# EAGLE design pll (EAGLE 7.2.0)
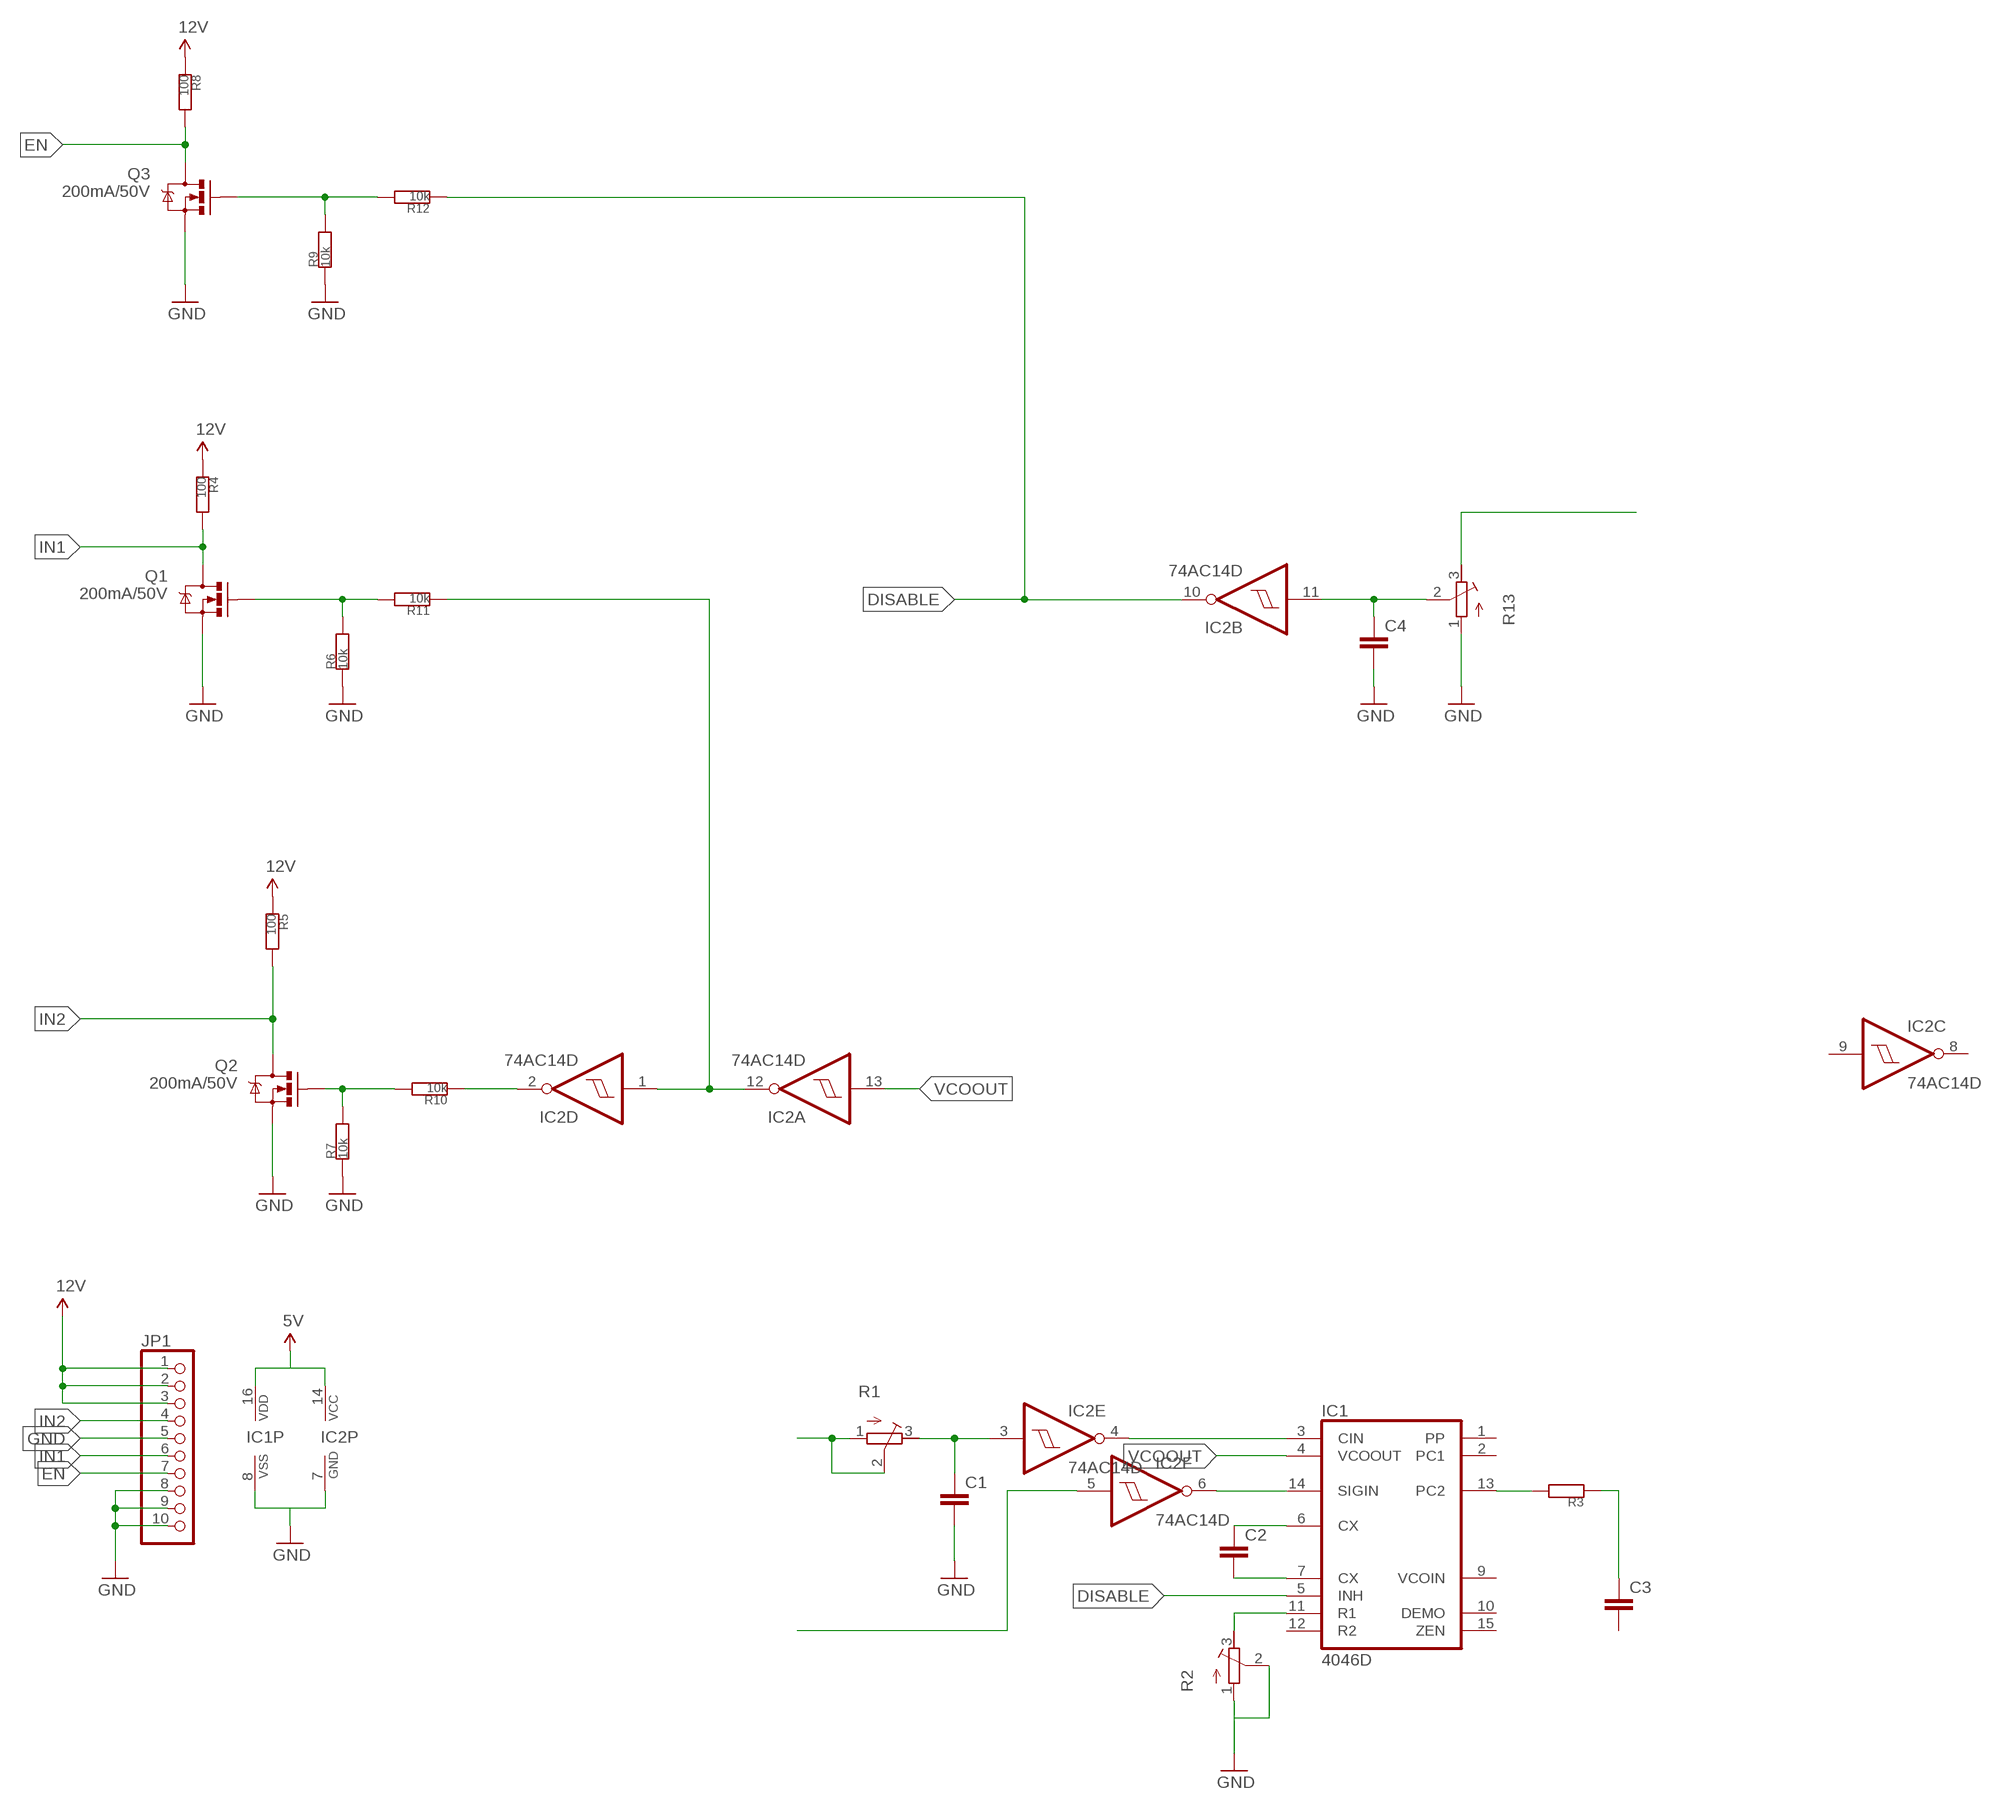
[diagram p0: schematic, sheet 1]

## Parts
C1  CC0805  [C0805]
C2  CC0805  [C0805]
C3  CC0805  [C0805]
C4  CC0805  [C0805]
IC1  4046D  [SO16]
IC2  74AC14D  [SO14]
JP1  PINHD-1X10  [1X10]
Q1  200mA/50V  MOSFET-NCHANNELBSS138  [SOT23-3]
Q2  200mA/50V  MOSFET-NCHANNELBSS138  [SOT23-3]
Q3  200mA/50V  MOSFET-NCHANNELBSS138  [SOT23-3]
R1  R-TRIMM64X  [RTRIM64X]
R2  R-TRIMM64X  [RTRIM64X]
R3  R0805  [R0805]
R4  100  R0805  [R0805]
R5  100  R0805  [R0805]
R6  10k  R0603  [0603]
R7  10k  R0603  [0603]
R8  100  R0805  [R0805]
R9  10k  R0603  [0603]
R10  10k  R0805  [R0805]
R11  10k  R0603  [0603]
R12  10k  R0603  [0603]
R13  R-TRIMM64X  [RTRIM64X]

## Nets
5V: IC1.16(VDD) IC2.14(P:VCC)
12V: JP1.1 JP1.2 JP1.3 R4.1 R5.1 R8.1
DISABLE: IC1.5(INH) IC2.10(B:O) R12.1
EN: JP1.7 Q3.3(D) R8.2
GND: C1.2 C4.2 IC1.8(VSS) IC2.7(P:GND) JP1.5 JP1.8 JP1.9 JP1.10 Q1.2(S) Q2.2(S) Q3.2(S) R2.1(A) R2.2(S) R6.1 R7.1 R9.1 R13.1(A)
IN1: JP1.6 Q1.3(D) R4.2
IN2: JP1.4 Q2.3(D) R5.2
N$1: IC1.14(SIGIN) IC2.6(F:O)
N$2: IC1.3(CIN) IC2.4(E:O)
N$3: C1.1 IC2.3(E:I) R1.3(E)
N$4: R1.1(A) R1.2(S)
N$5: C2.1 IC1.6(CX)
N$6: C2.2 IC1.7(CX)
N$7: Q3.1(G) R9.2 R12.2
N$8: IC2.1(D:I) IC2.12(A:O) R11.1
N$9: Q2.1(G) R7.2 R10.2
N$10: IC1.13(PC2) R3.2
N$11: C3.1 R3.1
N$13: Q1.1(G) R6.2 R11.2
N$14: IC2.5(F:I)
N$15: IC2.2(D:O) R10.1
N$16: IC1.11(R1) R2.3(E)
N$17: C4.1 IC2.11(B:I) R13.2(S)
N$18: R13.3(E)
VCOOUT: IC1.4(VCOOUT) IC2.13(A:I)
Unconnected: C3.2 IC1.1(PP) IC1.2(PC1) IC1.9(VCOIN) IC1.10(DEMO) IC1.12(R2) IC1.15(ZEN) IC2.8(C:O) IC2.9(C:I)

## Library data of the parts
C1-C4 = CasaLibrary:C: Capacitor
IC1 = 40xx:4046: Micropower PLL
IC2 = 74xx-eu:74*14: Hex schmitt trigger INVERTER
JP1 = pinhead:PINHD-1X10: PIN HEADER
Q1-Q3 = SparkFun-DiscreteSemi:MOSFET-NCHANNEL: Common NMOSFET Parts MFG P/N Store ID Prod ID FDD8780 TRANS-09984 SI7820DN TRANS-11055 FDS6630A IC-08089 2N7002PW TRANS-11151 FQP30N06L COM-10213 TRANS-10060 BSS123LT1G TRANS-08345 BSS138 TRANS-00830 BS170 2N7000; PROD_ID: TRANS-00830
R1 R2 R13 = rcl:R-TRIMM: Trimm resistor
R3-R12 = CasaLibrary:R

## Board
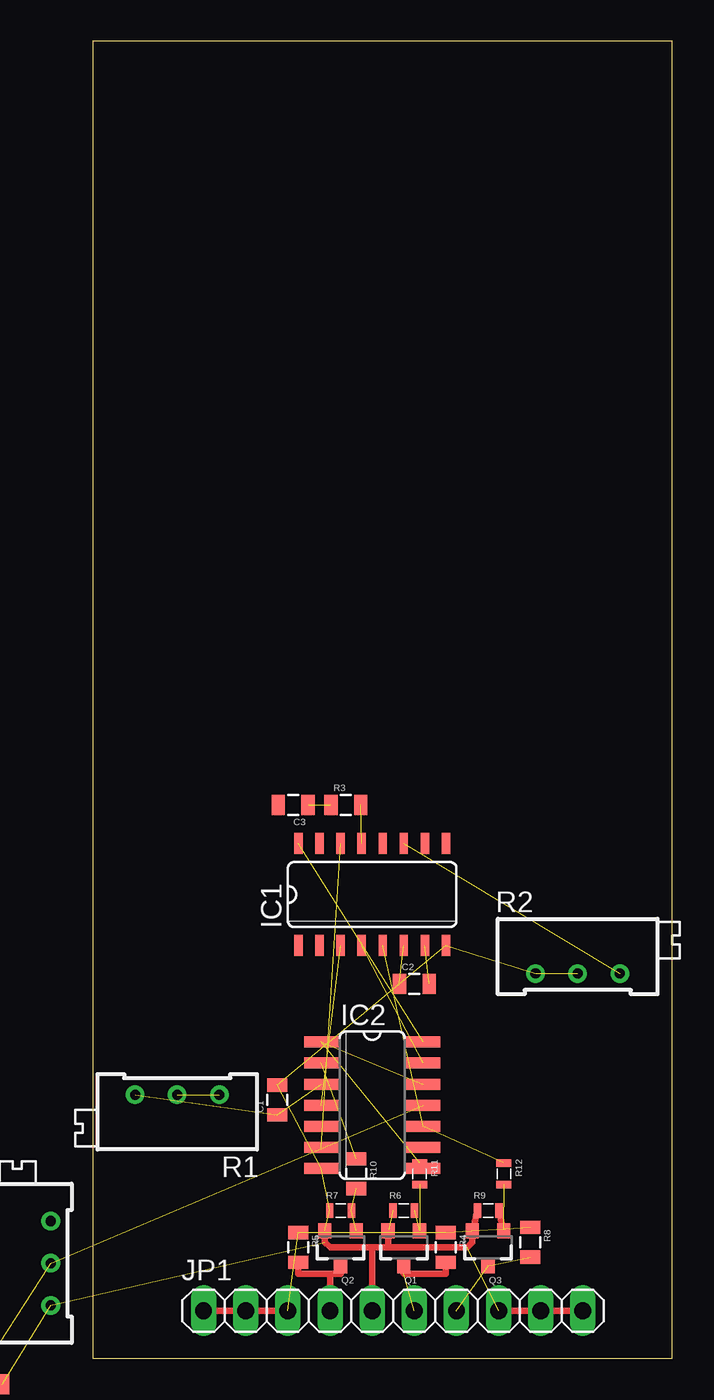
[diagram p1: board, top side]

Size 34.91 x 79.36 mm. Coordinates in mm from the lower left corner, seen from the top.
Outline: 0,0 34.91,0 34.91,79.36 0,79.36 0,0
Copper layers (1*16): Top 0.035mm / dielectric 1.5mm / Bottom 0.035mm
Design rules "default": minimum track width 0.2mm, minimum drill 0.2mm, track to track 0.2mm, track to pad 0.2mm, pad to pad 0.2mm, via to via 0.2mm, smd to smd 0.2mm, copper to edge 0.2mm, drill to drill 0.2mm, minimum pad ring 10mil, minimum via ring 8mil, stop-mask expansion 4mil, vias tented up to drill 0mil, thermal gap 10mil

### Footprints (pad centres in the part's own frame; a part is rotated, then mirrored left to right if it is on the bottom)
C0805 = smd 0.8 x 1.2: 1 -0.9,0; 2 0.9,0
SO16 = smd 0.5 x 1.25: 1 -4.445,-3.073; 2 -3.175,-3.073; 3 -1.905,-3.073; 4 -0.635,-3.073; 5 0.635,-3.073; 6 1.905,-3.073; 7 3.175,-3.073; 8 4.445,-3.073; 9 4.445,3.073; 10 3.175,3.073; 11 1.905,3.073; 12 0.635,3.073; 13 -0.635,3.073; 14 -1.905,3.073; 15 -3.175,3.073; 16 -4.445,3.073
SO14 = smd 0.66 x 2.032: 1 -3.81,-3.073; 2 -2.54,-3.073; 3 -1.27,-3.073; 4 0,-3.073; 5 1.27,-3.073; 6 2.54,-3.073; 7 3.81,-3.073; 8 3.81,3.073; 9 2.54,3.073; 10 1.27,3.073; 11 0,3.073; 12 -1.27,3.073; 13 -2.54,3.073; 14 -3.81,3.073
1X10 = drill 1.016 long: 1 -11.43,0; 2 -8.89,0; 3 -6.35,0; 4 -3.81,0; 5 -1.27,0; 6 1.27,0; 7 3.81,0; 8 6.35,0; 9 8.89,0; 10 11.43,0
SOT23-3 = smd 0.8 x 0.9: 1 -0.95,-1; 2 0.95,-1; 3 0,1.1
RTRIM64X = drill 0.61: 1 1.27,-2.54; 2 1.27,0; 3 1.27,2.54
R0805 = smd 0.8 x 1.2: 1 -0.9,0; 2 0.9,0
0603 = smd 0.45 x 0.9: 1 -0.65,0; 2 0.65,0

### Placement (x,y rotation side)
C1  11.11,15.56 90 top
C2  19.37,22.54 0 top
C3  12.06,33.34 180 top
C4  -6.35,-1.59 0 top  (outside the outline)
IC1  16.83,27.94 0 top
IC2  16.83,15.24 270 top
JP1  18.1,2.86 0 top
Q1  18.73,6.67 180 top
Q2  14.92,6.67 180 top
Q3  23.81,6.67 180 top
R1  5.08,14.61 90 top
R2  29.21,24.45 270 top
R3  15.24,33.34 0 top
R4  21.27,6.67 270 top
R5  12.38,6.67 270 top
R6  18.73,8.89 0 top
R7  14.92,8.89 0 top
R8  26.35,6.99 270 top
R9  23.81,8.89 0 top
R10  15.88,11.11 270 top
R11  19.68,11.11 270 top
R12  24.77,11.11 270 top
R13  -3.81,5.71 0 top

### Tracks (layer width: path | path; a pad name or v marks a point on that pad's centre or on a via)
5V  (1 unrouted)
12V  (3 unrouted)
  Top 0.406: JP1.1 JP1.2 JP1.3
DISABLE  (2 unrouted)
EN  (2 unrouted)
GND  (10 unrouted)
  Top 0.406: JP1.10 JP1.9 JP1.8 | JP1.5 16.83,6.67 | 16.83,6.67 14.29,6.67 13.97,6.99 Q2.2 | 16.83,6.67 17.78,6.67 | 17.78,6.67 22.54,6.67 22.86,6.99 Q3.2 22.91,7.72 R9.1 | 17.78,6.67 Q1.2 17.83,7.72
IN1  (1 unrouted)
  Top 0.406: Q1.3 18.73,5.08 21.27,5.08 R4.2
IN2
  Top 0.406: R5.2 12.38,5.08 14.29,5.08 | 14.29,5.08 14.92,5.08 Q2.3 | JP1.4 14.29,5.08
N$1  (1 unrouted)
N$2  (1 unrouted)
N$3  (2 unrouted)
N$4  (1 unrouted)
N$5  (1 unrouted)
N$6  (1 unrouted)
N$7  (1 unrouted)
  Top 0.406: R9.2 24.71,7.72 Q3.1
N$8  (2 unrouted)
N$9  (2 unrouted)
N$10  (1 unrouted)
N$11  (1 unrouted)
N$13  (2 unrouted)
N$15  (1 unrouted)
N$16  (1 unrouted)
N$17  (2 unrouted)
VCOOUT  (1 unrouted)